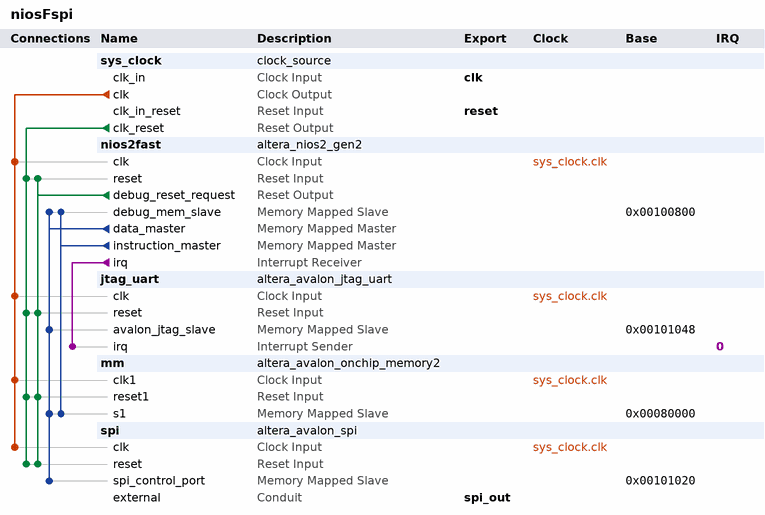
[diagram p0: system contents]
# Platform Designer (Qsys) system niosFspi, Stratix IV EP4SGX530KH40C2
# Parameters at their usual value, and those the tool derives, are not listed.
package require -exact qsys 16.0
create_system niosFspi
set_project_property DEVICE_FAMILY {Stratix IV}
set_project_property DEVICE EP4SGX530KH40C2

add_instance sys_clock clock_source 16.0
set_instance_parameter_value sys_clock clockFrequency 125000000

add_instance nios2fast altera_nios2_gen2 16.0
set_instance_parameter_value nios2fast dcache_size 0
set_instance_parameter_value nios2fast exceptionSlave mm.s1
set_instance_parameter_value nios2fast icache_size 4096
set_instance_parameter_value nios2fast impl Fast
set_instance_parameter_value nios2fast resetSlave mm.s1

add_instance jtag_uart altera_avalon_jtag_uart 16.0
set_instance_parameter_value jtag_uart simInteractiveOptions NO_INTERACTIVE_WINDOWS

add_instance mm altera_avalon_onchip_memory2 16.0
set_instance_parameter_value mm dataWidth 32
set_instance_parameter_value mm dualPort false
set_instance_parameter_value mm initMemContent true
set_instance_parameter_value mm initializationFileName onchip_mem.hex
set_instance_parameter_value mm memorySize 307200

add_instance spi altera_avalon_spi 16.0
set_instance_parameter_value spi clockPolarity 0
set_instance_parameter_value spi dataWidth 8
set_instance_parameter_value spi masterSPI true
set_instance_parameter_value spi numberOfSlaves 1
set_instance_parameter_value spi targetClockRate 15000000
set_instance_parameter_value spi targetSlaveSelectToSClkDelay 2.0

# connections
add_connection sys_clock.clk jtag_uart.clk clock
add_connection sys_clock.clk mm.clk1 clock
add_connection sys_clock.clk nios2fast.clk clock
add_connection sys_clock.clk spi.clk clock
add_connection nios2fast.debug_reset_request jtag_uart.reset reset
add_connection nios2fast.debug_reset_request mm.reset1 reset
add_connection nios2fast.debug_reset_request nios2fast.reset reset
add_connection nios2fast.debug_reset_request spi.reset reset
add_connection sys_clock.clk_reset jtag_uart.reset reset
add_connection sys_clock.clk_reset mm.reset1 reset
add_connection sys_clock.clk_reset nios2fast.reset reset
add_connection sys_clock.clk_reset spi.reset reset
add_connection nios2fast.data_master jtag_uart.avalon_jtag_slave avalon
set_connection_parameter_value nios2fast.data_master/jtag_uart.avalon_jtag_slave baseAddress 0x00101048
add_connection nios2fast.data_master mm.s1 avalon
set_connection_parameter_value nios2fast.data_master/mm.s1 baseAddress 0x00080000
add_connection nios2fast.data_master nios2fast.debug_mem_slave avalon
set_connection_parameter_value nios2fast.data_master/nios2fast.debug_mem_slave baseAddress 0x00100800
add_connection nios2fast.data_master spi.spi_control_port avalon
set_connection_parameter_value nios2fast.data_master/spi.spi_control_port baseAddress 0x00101020
add_connection nios2fast.instruction_master mm.s1 avalon
set_connection_parameter_value nios2fast.instruction_master/mm.s1 baseAddress 0x00080000
add_connection nios2fast.instruction_master nios2fast.debug_mem_slave avalon
set_connection_parameter_value nios2fast.instruction_master/nios2fast.debug_mem_slave baseAddress 0x00100800
add_connection nios2fast.irq jtag_uart.irq interrupt
set_connection_parameter_value nios2fast.irq/jtag_uart.irq irqNumber 0

# exported interfaces
add_interface clk clock sink
set_interface_property clk EXPORT_OF sys_clock.clk_in
add_interface reset reset sink
set_interface_property reset EXPORT_OF sys_clock.clk_in_reset
add_interface spi_out conduit end
set_interface_property spi_out EXPORT_OF spi.external

set_interconnect_requirement {$system} qsys_mm.clockCrossingAdapter HANDSHAKE
set_interconnect_requirement {$system} qsys_mm.enableEccProtection FALSE
set_interconnect_requirement {$system} qsys_mm.insertDefaultSlave FALSE
set_interconnect_requirement {$system} qsys_mm.maxAdditionalLatency 1

save_system niosFspi.qsys
